# Altium schematic sheet SmartHiveClient_min_V1.0.SchDoc
size A4
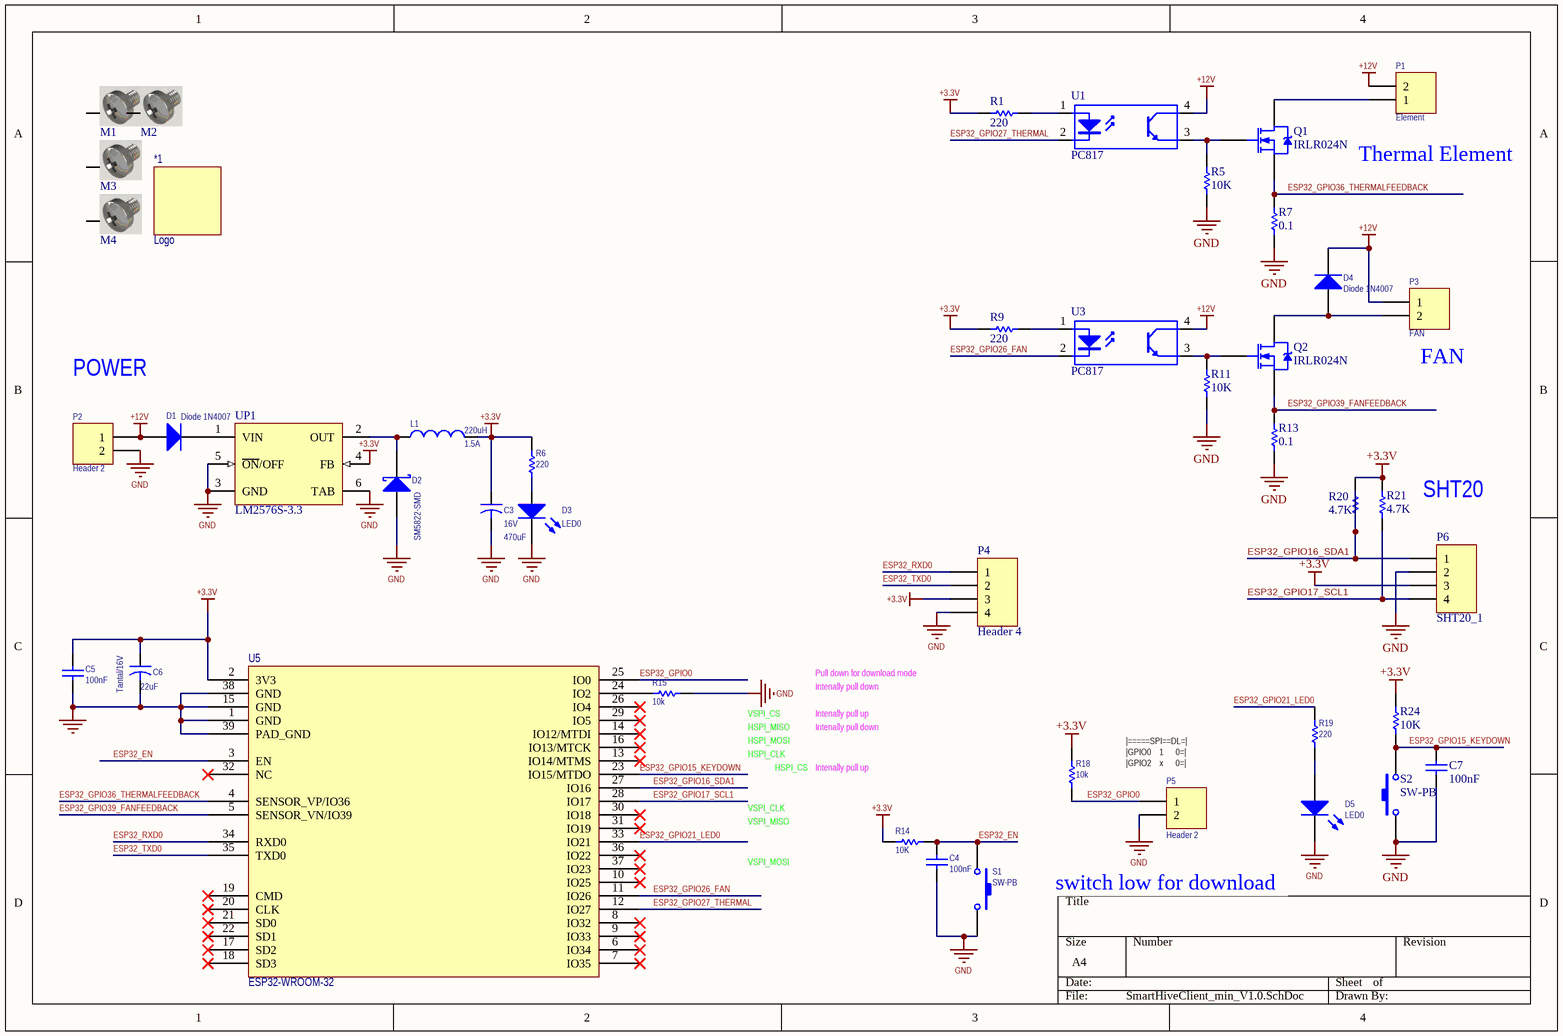
[diagram p0: SmartHiveClient_min_V1.0.SchDoc]

## Parts
*1  Logo  [LOGO_PARS_TOP]
C3  16V  value 470uF  [Cap electrolitic radial 8x12-3.5]
C4  100nF  [CAP0805]
C5  100nF  [CAP0805]
C6  Tantal/16V  value 22uF  [CAP_TANTAL_TYPE_B]
C7  100nF  [CAP0805]
D1  Diode 1N4007  [DO-241AC]
D2  SM5822-SMD  [430X270D]
D3  LED0  [LED_0805]
D4  Diode 1N4007  [DO-241AC]
D5  LED0  [LED_0805]
L1  1.5A  value 220uH  [Inductor SMD 3x3.2mm]
M1  Screw3mm  [Board Screw 3mm]  (value not drawn)
M2  Screw3mm  [Board Screw 3mm]  (value not drawn)
M3  Screw3mm  [Board Screw 3mm]  (value not drawn)
M4  Screw3mm  [Board Screw 3mm]  (value not drawn)
P1  Element  [MSTBV 2,5/2-G-5]
P2  Header 2  [KF301 2PIN]
P3  FAN  [DS1070-2-COMCON]
P4  Header 4  [HDR1X4]
P5  Header 2  [Jumper Small - 2.54 - Black]
P6  SHT20_1  [XH-4PIN]
Q1  IRLR024N  [TO252-3M]
Q2  IRLR024N  [TO252-3M]
R1  220  [RES0805]
R5  10K  [RES0805]
R6  220  [RES0805]
R7  0.1  [RES2512]
R9  220  [RES0805]
R11  10K  [RES0805]
R13  0.1  [RES2512]
R14  10K  [RES0805]
R15  10k  [RES0805]
R18  10k  [RES0805]
R19  220  [RES0805]
R20  4.7K  [RES0805]
R21  4.7K  [RES0805]
R24  10K  [RES0805]
S1  SW-PB  [SW-2PIN-SMD]
S2  SW-PB  [SW-2PIN-SMD]
U1  PC817  [DIP_4]
U3  PC817  [DIP_4]
U5  ESP32-WROOM-32  [ESP32-WROOM-32D]
UP1  LM2576S-3.3  [TO263]

## Nets
+3.3V: C3.1 C5.2 C6.1 L1.2 P4.3 P6.3 R1.1 R6.2 R9.1 R14.2 R18.2 R20.2 R21.2 R24.2 U5.2(3V3) UP1.4(FB)
+12V: D1.1(A) D4.2(K) P1.2 P2.1 P3.1 U1.4(C) U3.4(C)
GND: C3.2 C4.1 C5.1 C6.2 C7.1 D2.1(A) D3.2(K) D5.2(K) P2.2 P4.4 P5.2 P6.2 R5.1 R7.1 R11.1 R13.1 R15.1 S1.2 S2.2 U5.1(GND) U5.15(GND) U5.38(GND) U5.39(PAD_GND) UP1.3(GND) UP1.5(~{ON}/OFF) UP1.6(TAB)
ESP32_EN: C4.2 R14.1 S1.1 U5.3(EN)
ESP32_GPIO0: P5.1 R18.1 U5.25(IO0)
ESP32_GPIO15_KEYDOWN: C7.2 R24.1 S2.1 U5.23(IO15/MTDO)
ESP32_GPIO16_SDA1: P6.1 R20.1 U5.27(IO16)
ESP32_GPIO17_SCL1: P6.4 R21.1 U5.28(IO17)
ESP32_GPIO21_LED0: R19.1 U5.33(IO21)
ESP32_GPIO26_FAN: U3.2(K) U5.11(IO26)
ESP32_GPIO27_THERMAL: U1.2(K) U5.12(IO27)
ESP32_GPIO36_THERMALFEEDBACK: Q1.3(S) R7.2 U5.4(SENSOR_VP/IO36)
ESP32_GPIO39_FANFEEDBACK: Q2.3(S) R13.2 U5.5(SENSOR_VN/IO39)
ESP32_RXD0: P4.1 U5.34(RXD0)
ESP32_TXD0: P4.2 U5.35(TXD0)
NetD1_2: D1.2(K) UP1.1(VIN)
NetD2_2: D2.2(K) L1.1 UP1.2(OUT)
NetD3_1: D3.1(A) R6.1
NetD4_1: D4.1(A) P3.2 Q2.4(D)
NetD5_1: D5.1(A) R19.2
NetP1_1: P1.1 Q1.4(D)
NetQ1_1: Q1.1(G) R5.2 U1.3(E)
NetQ2_1: Q2.1(G) R11.2 U3.3(E)
NetR1_2: R1.2 U1.1(A)
NetR9_2: R9.2 U3.1(A)
NetR15_2: R15.2 U5.24(IO2)

Not connected (* = marked no-connect by the designer): M1 S; M2 S; M3 S; M4 S; U5 6(IO34)* 7(IO35)* 8(IO32)* 9(IO33)* 10(IO25)* 13(IO14/MTMS)* 14(IO12/MTDI)* 16(IO13/MTCK)* 17(SD2)* 18(SD3)* 19(CMD)* 20(CLK)* 21(SD0)* 22(SD1)* 26(IO4)* 29(IO5)* 30(IO18)* 31(IO19)* 32(NC)* 36(IO22)* 37(IO23)*

## Notes on the sheet
- (near P1) Thermal Element
- POWER
- (near P3) FAN
- SHT20
- VSPI_CS
- Intenally pull down
- Pull down for download mode
- Intenally pull up
- HSPI_MOSI
- HSPI_MISO
- HSPI_CLK
- HSPI_CS
- (near P5) |=====SPI==DL=|
  |GPIO0    1      0=|
  |GPIO2    x      0=|
  |=============|
- VSPI_MISO
- VSPI_CLK
- VSPI_MOSI
- switch low for download

## Library data of the parts
C3 C6 = Cap2: Capacitor; Published: 23-Sep-2002; PackageReference: CAPR5-4X5; Publisher: Altium Limited; PackageDescription: Capacitor; 2 Leads
C4 C5 C7 = Cap: Capacitor; Published: 8-Jun-2000; LatestRevisionDate: 17-Jul-2002; LatestRevisionNote: Re-released for DXP Platform.; PackageReference: RAD-0.3; Publisher: Altium Limited; PackageDescription: Radial Cap, Thru-Hole; 2 Leads; 0.3 in Pin Spacing; Value: 100nF
D1 D4 = Diode 1N4007: 1 Amp General Purpose Rectifier; Published: 8-Jun-2000; LatestRevisionDate: 17-Jul-2002; LatestRevisionNote: Re-released for DXP Platform.; DatasheetVersion: 1998; PackageVersion: Aug-1999; PackageReference: DO-41; Publisher: Altium Limited; PackageDescription: Diode, Axial; Body 5.2 x 2.7 mm (LxDia. max), Lead Dia. 0.86 mm (max); Code_JEDEC: DO-204-AL; ComponentLink1Description: Manufacturer Link; ComponentLink1URL: http://www.fairchildsemi.com/; ComponentLink2Description: Datasheet; ComponentLink2URL: http://www.fairchildsemi.com/ds/1N%2F1N4001.pdf
D2 = D Schottky: Schottky Diode; Parameter 1: 1n5822; Published: 8-Jun-2000; LatestRevisionDate: 17-Jul-2002; LatestRevisionNote: Re-released for DXP Platform.; PackageReference: SMB; Publisher: Altium Limited; PackageDescription: DO-214-AA/SMB; 2 C-Bend Leads; Body 5.3 x 3.6 mm, inc. leads (LxW); Code_JEDEC: DO-214-AA
D3 D5 = LED0: Typical INFRARED GaAs LED; Published: 8-Jun-2000; LatestRevisionDate: 08-Jul-2005; LatestRevisionNote: Mech Layer 1 removed.; PackageReference: LED-0; Publisher: Altium Limited; PackageDescription: LED; 2 Leads
L1 = Inductor: Code_IEC: 1005; Published: 8-Jun-2000; LatestRevisionDate: 29-May-2009; LatestRevisionNote: IPC-7351 Footprint Added.; PackageReference: 0402-A; Publisher: Altium Limited; PackageDescription: Chip Inductor; Code_JEITA: 0402
M1-M4 = Board Screw 3mm: Board Screw With Spacer 3mm; Designer: Abbas Basereh; Data: 16-12-2016; Link: *; Part. No: *
P1-P3 P5 = Header 2: Header, 2-Pin; LatestRevisionDate: 17-Jul-2002; LatestRevisionNote: Re-released for DXP Platform.; Publisher: Altium Limited
P4 P6 = Header 4: Header, 4-Pin; LatestRevisionDate: 17-Jul-2002; LatestRevisionNote: Re-released for DXP Platform.; Publisher: Altium Limited
Q1 Q2 = IRLR024N: HEXFET Power MOSFET; Note: Pin 2 is trimmed and is electrically connected to Drain.; Published: 8-Jun-2000; LatestRevisionDate: 20-Nov-2009; LatestRevisionNote: IPC-7351 Footprint Added.; PackageVersion: Feb-2003; PackageReference: TO-252AA; Publisher: Altium Limited; PackageDescription: 3-Pin HEXFET Package 2.28 mm Pitch, 9.9 mm Lead Span; Code_JEDEC: TO-252-AA; ComponentLink1Description: Manufacturer Link; ComponentLink1URL: http://www.irf.com/; ComponentLink2Description: Datasheet; ComponentLink2URL: http://www.irf.com/product-info/datasheets/data/irlr024n.pdf
R1 R5 R6 R9 R11 R14 R15 R18-R21 R24 = Res1: Resistor; Published: 8-Jun-2000; LatestRevisionDate: 17-Jul-2002; LatestRevisionNote: Re-released for DXP Platform.; PackageReference: AXIAL-0.3; Publisher: Altium Limited; PackageDescription: Axial Device, Thru-Hole; 2 Leads; 0.3 in Pin Spacing
  R1 R6 R9 R19: Value: 220
  R5 R11 R14 R24: Value: 10K
  R15 R18: Value: 10k
  R20 R21: Value: 4.7K
R7 R13 = Res1: Size:2512,1%; Published: 8-Jun-2000; LatestRevisionDate: 17-Jul-2002; LatestRevisionNote: Re-released for DXP Platform.; PackageReference: AXIAL-0.3; Publisher: Altium Limited; PackageDescription: Axial Device, Thru-Hole; 2 Leads; 0.3 in Pin Spacing; Value: 0.1
S1 S2 = SW-PB: Switch; Published: 24-Mar-1999; LatestRevisionDate: 17-Jul-2002; LatestRevisionNote: Re-released for DXP Platform.; PackageReference: SPST-2; Publisher: Altium Limited; PackageDescription: Switch; 2 Leads
U1 U3 = Optoisolator1: 4-Pin Phototransistor Optocoupler; Published: 24-Mar-1999; LatestRevisionDate: 04-Mar-2005; LatestRevisionNote: Sch pins 3 & 4 Swapped.; DatasheetVersion: Nov-2003; PackageReference: DIP-4; Publisher: Altium Limited
U5 = ESP32-WROOM-32: ESP32  a single chip 2.4 GHz Wi-Fi and Bluetooth combo chip
UP1 = LM2576S-3.3: SIMPLE SWITCHER® 3A Step-Down Voltage Regulator, 5-pin TO-263; Manufacturer: National Semiconductor; PackageTopMarking: NSUZXYTTE#*LM2576S*-3.3 P+; PowerWise: N; Published: 4-Dec-2008; DatasheetVersion: Aug-2004; PackageVersion: revD, Apr-2005; PackageReference: TS5B; Publisher: Altium Limited; PackageDescription: TO-263, Molded, .400 x .390 x .180in, 5 Lead, .067in Pitch, Surface Mount; PartNumber: LM2576S-3.3; RoHS: N; PinCount: 5; CompType: Switcher; Code_JEDEC: MO-169-AB; ComponentLink1Description: LM2576 Datasheet; ComponentLink1URL: http://www.national.com/ds/LM/LM2576.pdf; ComponentLink2Description: LM2576 Web Page; ComponentLink2URL: http://www.national.com/pf/LM/LM2576.html; ComponentLink3Description: TS5B Package Page; ComponentLink3URL: http://www.national.com/packaging/folders/ts5b.html